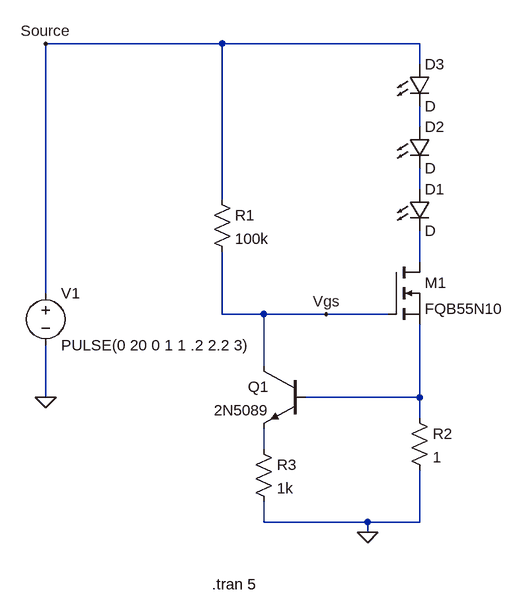
[diagram p0: schematic ConstantCurrentForLEDs1.asc]
ConstantCurrentForLEDs1.asc, the LTspice schematic file:
Version 4
SHEET 1 880 680
WIRE 144 -480 -128 -480
WIRE 448 -480 144 -480
WIRE 448 -448 448 -480
WIRE 448 -352 448 -384
WIRE 448 -256 448 -288
WIRE 144 -240 144 -480
WIRE 448 -144 448 -192
WIRE -128 -96 -128 -480
WIRE 144 -64 144 -160
WIRE 208 -64 144 -64
WIRE 304 -64 208 -64
WIRE 400 -64 304 -64
WIRE 208 16 208 -64
WIRE -128 64 -128 -16
WIRE 448 64 448 -48
WIRE 448 64 272 64
WIRE 448 96 448 64
WIRE 208 144 208 112
WIRE 208 256 208 224
WIRE 368 256 208 256
WIRE 448 256 448 176
WIRE 448 256 368 256
WIRE 368 272 368 256
FLAG 368 272 0
FLAG -128 64 0
FLAG -128 -480 Source
FLAG 304 -64 Vgs
SYMBOL npn 272 16 M0
SYMATTR InstName Q1
SYMATTR Value 2N5089
SYMBOL nmos 400 -144 R0
SYMATTR InstName M1
SYMATTR Value FQB55N10
SYMBOL res 128 -256 R0
SYMATTR InstName R1
SYMATTR Value 100k
SYMBOL res 432 80 R0
SYMATTR InstName R2
SYMATTR Value 1
SYMBOL voltage -128 -112 R0
WINDOW 123 0 0 Left 0
WINDOW 39 0 0 Left 0
SYMATTR InstName V1
SYMATTR Value PULSE(0 20 0 1 1 .2 2.2 3)
SYMBOL LED 432 -256 R0
SYMATTR InstName D1
SYMBOL LED 432 -352 R0
SYMATTR InstName D2
SYMBOL LED 432 -448 R0
SYMATTR InstName D3
SYMBOL res 192 128 R0
SYMATTR InstName R3
SYMATTR Value 1k
TEXT 128 352 Left 2 !.tran 5

The netlist it stands for:
* ConstantCurrentForLEDs1.asc
Q1 Vgs N004 N005 0 2N5089
M1 N003 Vgs N004 N004 FQB55N10
R1 Source Vgs 100k
R2 N004 0 1
V1 Source 0 PULSE(0 20 0 1 1 .2 2.2 3)
D1 N002 N003 D
D2 N001 N002 D
D3 Source N001 D
R3 N005 0 1k
.model D D
.lib standard.dio
.model NPN NPN
.model PNP PNP
.lib standard.bjt
.model NMOS NMOS
.model PMOS PMOS
.lib standard.mos
.tran 5
.backanno
.end